# EAGLE design 110 New Top Board (EAGLE 7.4.0)
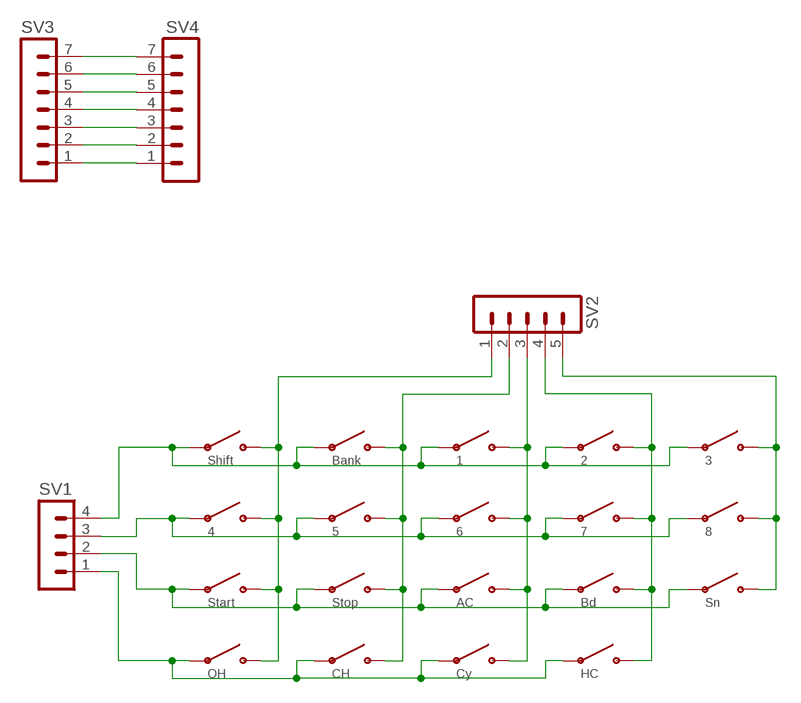
[diagram p0: schematic, sheet 1]

## Parts
SV1  MA04-1  [MA04-1]
SV2  MA05-1  [MA05-1]
SV3  MA07-1  [MA07-1]
SV4  MA07-1  [MA07-1]
U$1  AC  DR110-BUTTON  [DR110-PAD]
U$2  Bd  DR110-BUTTON  [DR110-PAD]
U$3  Sn  DR110-BUTTON  [DR110-PAD]
U$4  OH  DR110-BUTTON  [DR110-PAD]
U$5  CH  DR110-BUTTON  [DR110-PAD]
U$6  Cy  DR110-BUTTON  [DR110-PAD]
U$7  HC  DR110-BUTTON  [DR110-PAD]
U$8  Shift  DR110-BUTTON  [DR110-PAD]
U$9  Bank  DR110-BUTTON  [DR110-PAD]
U$10  1  DR110-BUTTON  [DR110-PAD]
U$11  2  DR110-BUTTON  [DR110-PAD]
U$12  3  DR110-BUTTON  [DR110-PAD]
U$13  4  DR110-BUTTON  [DR110-PAD]
U$14  5  DR110-BUTTON  [DR110-PAD]
U$15  6  DR110-BUTTON  [DR110-PAD]
U$16  7  DR110-BUTTON  [DR110-PAD]
U$17  8  DR110-BUTTON  [DR110-PAD]
U$19  Start  DR110-BUTTON  [DR110-PAD]
U$20  Stop  DR110-BUTTON  [DR110-PAD]

## Nets
N$1: SV1.1 U$4.P$1 U$5.P$1 U$6.P$1 U$7.P$1
N$2: SV2.1 U$4.P$2 U$8.P$2 U$13.P$2 U$19.P$2
N$3: SV2.2 U$5.P$2 U$9.P$2 U$14.P$2 U$20.P$2
N$4: SV2.3 U$1.P$2 U$6.P$2 U$10.P$2 U$15.P$2
N$5: SV1.2 U$1.P$1 U$2.P$1 U$3.P$1 U$19.P$1 U$20.P$1
N$6: SV1.3 U$13.P$1 U$14.P$1 U$15.P$1 U$16.P$1 U$17.P$1
N$7: SV3.1 SV4.1
N$8: SV1.4 U$8.P$1 U$9.P$1 U$10.P$1 U$11.P$1 U$12.P$1
N$9: SV3.2 SV4.2
N$10: SV3.3 SV4.3
N$11: SV2.4 U$2.P$2 U$7.P$2 U$11.P$2 U$16.P$2
N$12: SV2.5 U$3.P$2 U$12.P$2 U$17.P$2
N$13: SV3.4 SV4.4
N$14: SV3.5 SV4.5
N$15: SV3.6 SV4.6
N$16: SV3.7 SV4.7

## Library data of the parts
SV1 = con-lstb:MA04-1: PIN HEADER; OC_FARNELL: unknown; OC_NEWARK: unknown
SV2 = con-lstb:MA05-1: PIN HEADER; OC_FARNELL: unknown; OC_NEWARK: unknown
SV3 SV4 = con-lstb:MA07-1: PIN HEADER; OC_FARNELL: unknown; OC_NEWARK: unknown
U$1-U$17 U$19 U$20 = Adafruit Trellis:DR110-BUTTON

## Board
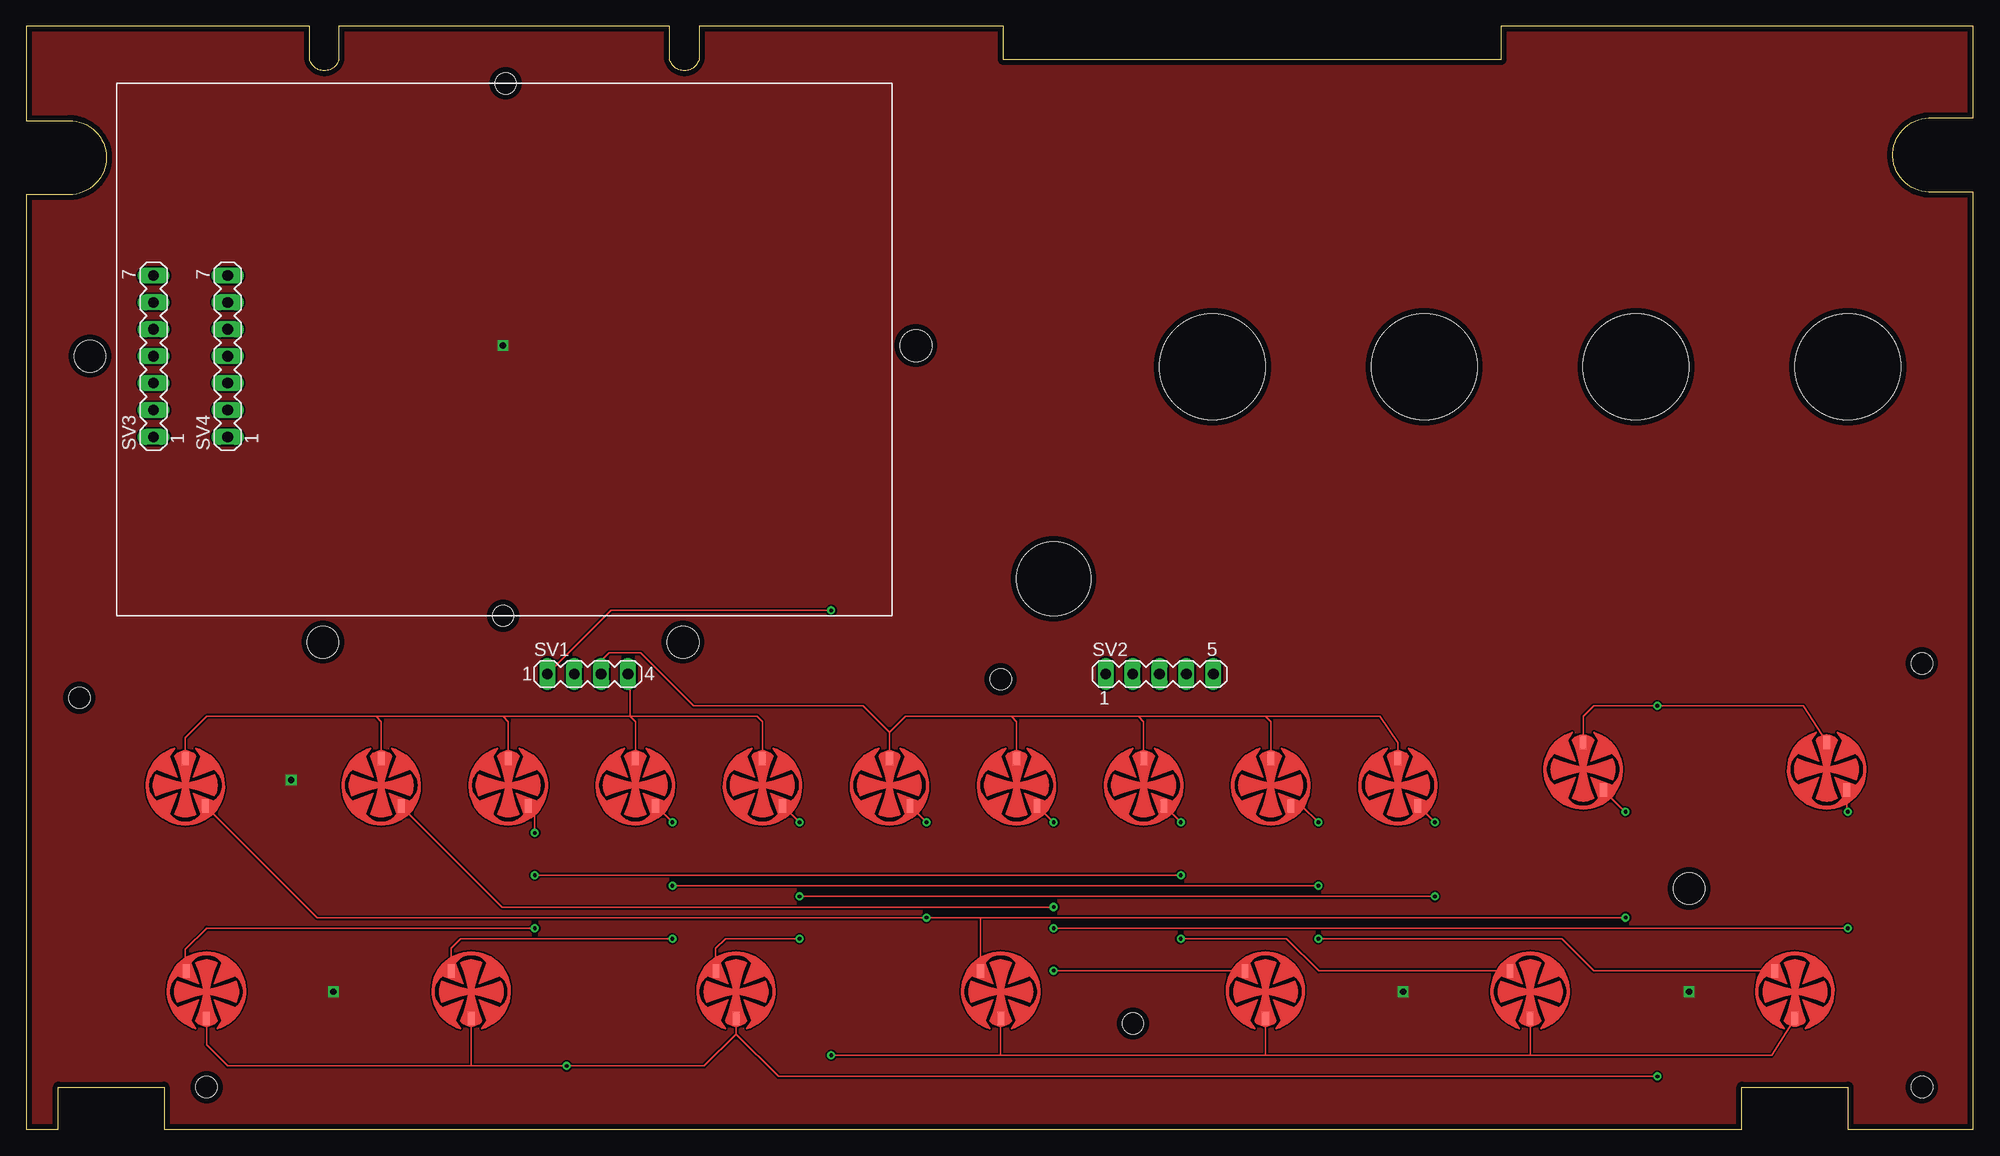
[diagram p1: board, top side]
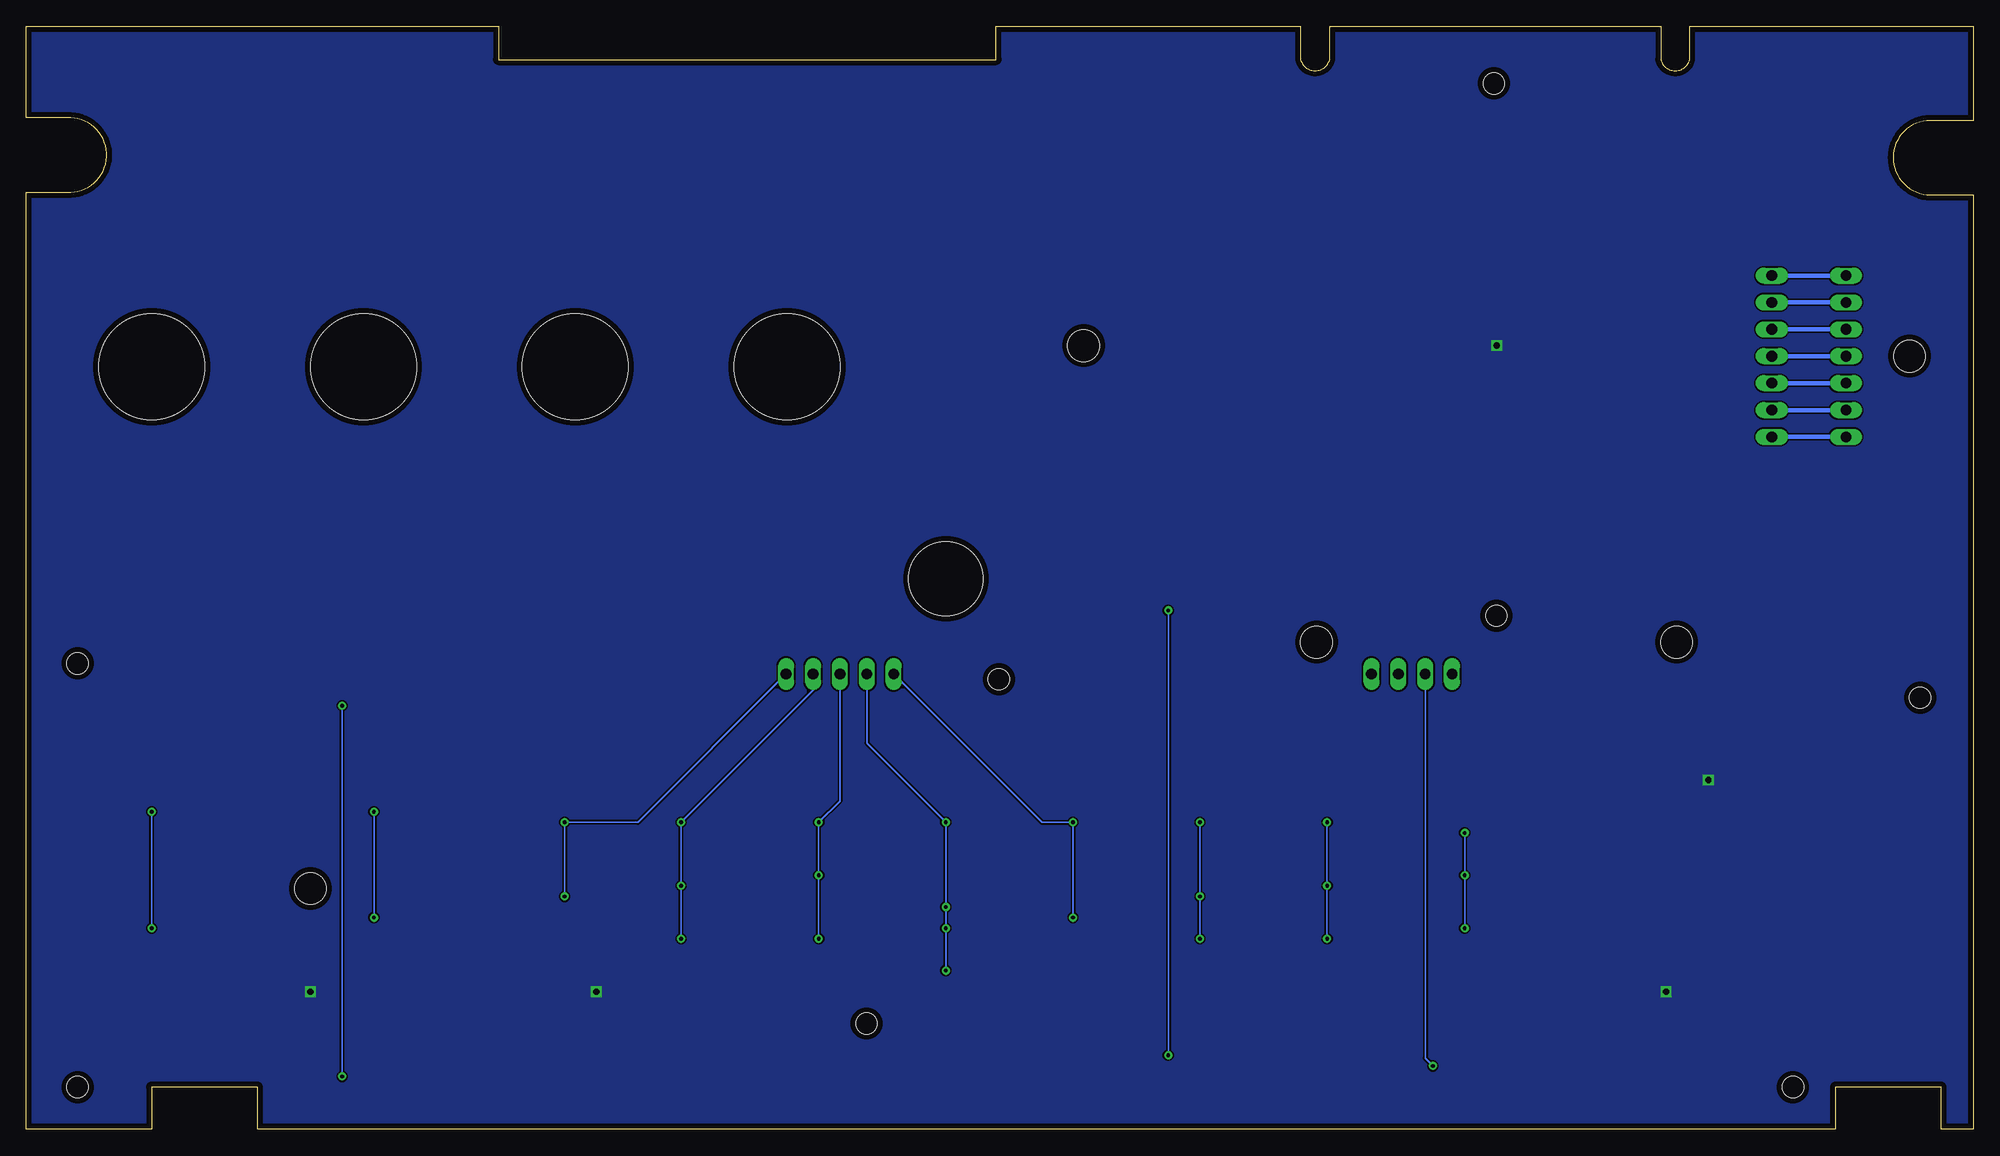
[diagram p2: board, bottom side, seen from below]

Size 183.82 x 104.13 mm. Coordinates in mm from the lower left corner, seen from the top.
Outline: 0,0 3,0 3,4 13,4 13,0 162,0 162,4 172,4 172,0 183.82,0 183.82,88.5 180,88.5 arc-188 180,95.5 183.82,95.5 183.82,104.13 139.25,104.13 139.25,101 92.25,101 92.25,104.13 63.5,104.13 63.5,101 arc-149 60.75,101 60.75,104.13 29.5,104.13 29.5,101 arc-149 26.75,101 26.75,104.13 0,104.13 0,95.25 4,95.25 arc-181 4,88.25 0,88.25 0,0
Copper layers (1*16): Top 0.035mm / dielectric 1.5mm / Bottom 0.035mm
Design rules "default *": minimum track width 6mil, minimum drill 0.35mm, track to track 6mil, track to pad 6mil, pad to pad 6mil, via to via 6mil, smd to smd 6mil, copper to edge 20mil, drill to drill 6mil, minimum pad ring 10mil, minimum via ring 8mil, stop-mask expansion 4mil, vias tented up to drill 0mil, thermal gap 10mil
Holes 10 mm at 112,72 132,72 152,72 172,72
Holes 7 mm at 97,52
Holes 3 mm at 84,74 6,73 28,46 62,46 157,22.75
Holes 2 mm at 179,44 179,4 5,40.75 17,4 92,42.5 104.5,10 45.25,98.75 45,48.5

### Footprints (pad centres in the part's own frame; a part is rotated, then mirrored left to right if it is on the bottom)
MA04-1 = drill 1.016 long: 1 -3.81,0; 2 -1.27,0; 3 1.27,0; 4 3.81,0
MA05-1 = drill 1.016 long: 1 -5.08,0; 2 -2.54,0; 3 0,0; 4 2.54,0; 5 5.08,0
MA07-1 = drill 1.016 long: 1 -7.62,0; 2 -5.08,0; 3 -2.54,0; 4 0,0; 5 2.54,0; 6 5.08,0; 7 7.62,0
DR110-PAD = smd 0.635 x 1.27: P$1 0,2.54; P$2 1.905,-1.968

### Placement (x,y rotation side)
SV1  53,43 0 top
SV2  107,43 0 top
SV3  12,73 90 top
SV4  19,73 90 top
U$1  17,13 180 top
U$2  42,13 180 top
U$3  67,13 180 top
U$4  92,13 180 top
U$5  117,13 180 top
U$6  142,13 180 top
U$7  167,13 180 top
U$8  15,32.5 0 top
U$9  33.5,32.5 0 top
U$10  45.5,32.5 0 top
U$11  57.5,32.5 0 top
U$12  69.5,32.5 0 top
U$13  81.5,32.5 0 top
U$14  93.5,32.5 0 top
U$15  105.5,32.5 0 top
U$16  117.5,32.5 0 top
U$17  129.5,32.5 0 top
U$19  147,34 0 top
U$20  170,34 0 top

### Tracks (layer width: path | path; a pad name or v marks a point on that pad's centre or on a via)
GND  (via drill 0.6)
  other vias: 45,74 25,33 29,13 130,13 157,13
  pour Top: 0,0 184,0 184,106 0,106
  pour Bottom: 0,105 185,105 185,-1 -1,-1 -1,105
N$1  (via drill 0.35)
  Top 0.152: U$7.P$1 164.81,7 142,7 | v76,7 92,7 | 92,7 117,7 | 117,7 142,7 | U$5.P$1 117,7 | U$6.P$1 142,7 | SV1.1 55.19,49 v76,49 | U$4.P$1 92,7
  Bottom 0.152: v76,49 v76,7
N$2  (via drill 0.35)
  Top 0.152: U$4.P$2 90.09,20 | U$19.P$2 150.94,30 v151,30 | v151,20 90.09,20 | U$8.P$2 27.44,20 v85,20 90.09,20 | U$13.P$2 83.47,30.53 v85,29
  Bottom 0.152: v151,30 v151,20 | v85,20 v85,29 87.92,29 SV2.1
N$3  (via drill 0.35)
  Top 0.152: U$5.P$2 97.03,14.97 v97,15 | v97,29 95.47,30.53 U$14.P$2 | v172,30 171.91,30.09 U$20.P$2 | U$9.P$2 44.94,21 v97,21 | v172,19 v97,19
  Bottom 0.152: v97,15 v97,19 v97,21 v97,29 104.46,36.46 SV2.2 | v172,19 v172,30
N$4  (via drill 0.35)
  Top 0.152: U$1.P$2 15,15.06 15,17 17,19 v48,19 | U$6.P$2 122.03,14.97 119,18 v109,18 | v109,29 107.47,30.53 U$15.P$2 | v48,28 48,29.94 U$10.P$2 | v109,24 v48,24
  Bottom 0.152: v109,18 v109,24 v109,29 107,31 SV2.3 | v48,19 v48,24 v48,28
N$5  (via drill 0.35)
  Top 0.152: U$1.P$1 17,8 19,6 42,6 | 42,6 v51,6 64,6 67,9 | U$2.P$1 42,6 | U$19.P$1 147,39 148,40 v154,40 167.81,40 U$20.P$1 | U$3.P$1 67,9 | 67,9 71,5 v154,5
  Bottom 0.152: v154,5 v154,40 | SV1.2 51.73,6.73 v51,6
N$6
  Top 0.152: U$13.P$1 81.5,37.5 | 81.5,37.5 83,39 93,39 | 93,39 105,39 | 105,39 117,39 | 117,39 127.81,39 129.5,36.51 U$17.P$1 | U$14.P$1 93.5,38.5 93,39 | U$15.P$1 105.5,38.5 105,39 | U$16.P$1 117.5,38.5 117,39 | SV1.3 54.27,44.27 55,45 58,45 63,40 79,40 81.5,37.5
N$7
  Bottom 0.406: SV3.1 SV4.1
N$8
  Top 0.152: U$8.P$1 15,37 17,39 33,39 | 57,39 69,39 69.5,38.5 U$12.P$1 | 57,39 45,39 | 45,39 33,39 | U$11.P$1 57.5,38.5 57,39 | U$10.P$1 45.5,38.5 45,39 | U$9.P$1 33.5,38.5 33,39 | SV1.4 57,42.81 57,39
N$9
  Bottom 0.406: SV3.2 SV4.2
N$10
  Bottom 0.406: SV3.3 SV4.3
N$11  (via drill 0.35)
  Top 0.152: U$7.P$2 148.03,14.97 145,18 v122,18 | v122,29 120.47,30.53 U$16.P$2 | U$2.P$2 40.09,17.09 41,18 v61,18 | v61,29 59.47,30.53 U$11.P$2 | v122,23 v61,23
  Bottom 0.152: v122,18 v122,23 v122,29 109.54,41.46 SV2.4 | v61,18 v61,23 v61,29
N$12  (via drill 0.35)
  Top 0.152: U$3.P$2 65.09,17.09 66,18 v73,18 | v73,29 71.47,30.53 U$12.P$2 | v73,22 v133,22 | v133,29 131.47,30.53 U$17.P$2
  Bottom 0.152: v73,18 v73,22 v73,29 | v133,22 v133,29 126.08,29 SV2.5
N$13
  Bottom 0.406: SV3.4 SV4.4
N$14
  Bottom 0.406: SV3.5 SV4.5
N$15
  Bottom 0.406: SV3.6 SV4.6
N$16
  Bottom 0.406: SV3.7 SV4.7